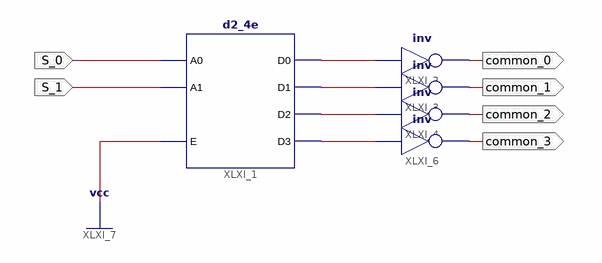
[diagram p0: schematic sheet 1]
// Xilinx ISE schematic COMMONS_SELECTOR.sch (spartan6) as structural Verilog: 5 symbols, 6 ports
module COMMONS_SELECTOR (
  input  S_0,
  input  S_1,
  output common_0,
  output common_1,
  output common_2,
  output common_3
);

  wire XLXN_4, XLXN_5, XLXN_6, XLXN_7;

  d2_4e XLXI_1 (.A0(S_0), .A1(S_1), .E(1'b1), .D0(XLXN_4), .D1(XLXN_5), .D2(XLXN_6), .D3(XLXN_7));
  not XLXI_2 (common_0, XLXN_4);
  not XLXI_3 (common_1, XLXN_5);
  not XLXI_4 (common_2, XLXN_6);
  not XLXI_6 (common_3, XLXN_7);
endmodule
